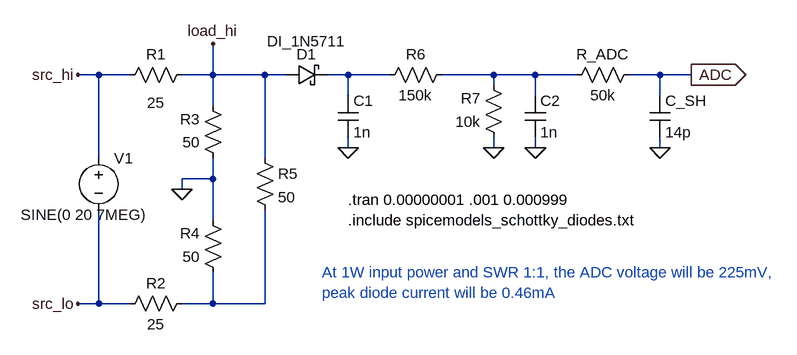
[diagram p0: schematic blinky-diode-curve-shorted.asc]
blinky-diode-curve-shorted.asc, the LTspice schematic file:
Version 4
SHEET 1 1676 680
WIRE -112 112 -144 112
WIRE -64 112 -112 112
WIRE 64 112 64 64
WIRE 64 112 16 112
WIRE 144 112 64 112
WIRE 176 112 144 112
WIRE 272 112 240 112
WIRE 336 112 272 112
WIRE 496 112 416 112
WIRE 560 112 496 112
WIRE 624 112 560 112
WIRE 752 112 704 112
WIRE 800 112 752 112
WIRE 496 128 496 112
WIRE 272 144 272 112
WIRE 560 144 560 112
WIRE 752 144 752 112
WIRE 64 160 64 112
WIRE 272 224 272 208
WIRE 496 224 496 208
WIRE 560 224 560 208
WIRE 752 224 752 208
WIRE -112 240 -112 112
WIRE 144 240 144 112
WIRE 64 272 64 240
WIRE 64 272 16 272
WIRE 16 288 16 272
WIRE 64 336 64 272
WIRE -112 464 -112 320
WIRE -112 464 -144 464
WIRE -64 464 -112 464
WIRE 64 464 64 416
WIRE 64 464 16 464
WIRE 144 464 144 320
WIRE 144 464 64 464
FLAG 16 288 0
FLAG 272 224 0
FLAG 496 224 0
FLAG 752 224 0
FLAG 800 112 ADC
IOPIN 800 112 Out
FLAG 64 64 load_hi
FLAG -144 112 src_hi
FLAG -144 464 src_lo
FLAG 560 224 0
SYMBOL voltage -112 224 R0
WINDOW 3 -120 103 Left 2
WINDOW 123 24 124 Left 2
WINDOW 39 0 0 Left 0
SYMATTR Value SINE(0 20 7MEG)
SYMATTR InstName V1
SYMBOL res 32 96 R90
WINDOW 0 0 56 VBottom 2
WINDOW 3 43 56 VTop 2
SYMATTR InstName R1
SYMATTR Value 25
SYMBOL cap 256 144 R0
SYMATTR InstName C1
SYMATTR Value 1n
SYMBOL schottky 176 128 R270
WINDOW 0 32 32 VTop 2
WINDOW 3 83 32 VBottom 2
SYMATTR InstName D1
SYMATTR Value DI_1N5711
SYMATTR Description Diode
SYMATTR Type diode
SYMBOL res 32 448 R90
WINDOW 0 0 56 VBottom 2
WINDOW 3 32 56 VTop 2
SYMATTR InstName R2
SYMATTR Value 25
SYMBOL res 80 256 R180
WINDOW 0 36 76 Left 2
WINDOW 3 36 40 Left 2
SYMATTR InstName R3
SYMATTR Value 50
SYMBOL res 80 432 R180
WINDOW 0 36 76 Left 2
WINDOW 3 36 40 Left 2
SYMATTR InstName R4
SYMATTR Value 50
SYMBOL res 128 224 R0
SYMATTR InstName R5
SYMATTR Value 50
SYMBOL res 432 96 R90
WINDOW 0 0 56 VBottom 2
WINDOW 3 32 56 VTop 2
SYMATTR InstName R6
SYMATTR Value 150k
SYMBOL res 512 224 R180
WINDOW 0 36 76 Left 2
WINDOW 3 36 40 Left 2
SYMATTR InstName R7
SYMATTR Value 10k
SYMBOL res 608 128 R270
WINDOW 0 32 56 VTop 2
WINDOW 3 0 56 VBottom 2
SYMATTR InstName R_ADC
SYMATTR Value 50k
SYMBOL cap 736 144 R0
SYMATTR InstName C_SH
SYMATTR Value 14p
SYMBOL cap 544 144 R0
SYMATTR InstName C2
SYMATTR Value 1n
TEXT 272 304 Left 2 !.tran 0.00000001 .001 0.000999
TEXT 272 336 Left 2 !.include spicemodels_schottky_diodes.txt
TEXT 232 416 Left 2 ;At 1W input power and SWR 1:1, the ADC voltage will be 225mV,\npeak diode current will be 0.46mA

The netlist it stands for:
* blinky-diode-curve-shorted.asc
V1 src_hi src_lo SINE(0 20 7MEG)
R1 load_hi src_hi 25
C1 N001 0 1n
D1 load_hi N001 DI_1N5711
R2 N003 src_lo 25
R3 0 load_hi 50
R4 N003 0 50
R5 load_hi N003 50
R6 N002 N001 150k
R7 0 N002 10k
R_ADC N002 ADC 50k
C_SH ADC 0 14p
C2 N002 0 1n
.model D D
.lib standard.dio
.tran 0.00000001 .001 0.000999
.include spicemodels_schottky_diodes.txt
* At 1W input power and SWR 1:1, the ADC voltage will be 225mV,
* peak diode current will be 0.46mA
.backanno
.end